# EAGLE design BMSMAX14921Based (EAGLE 8.3.1)
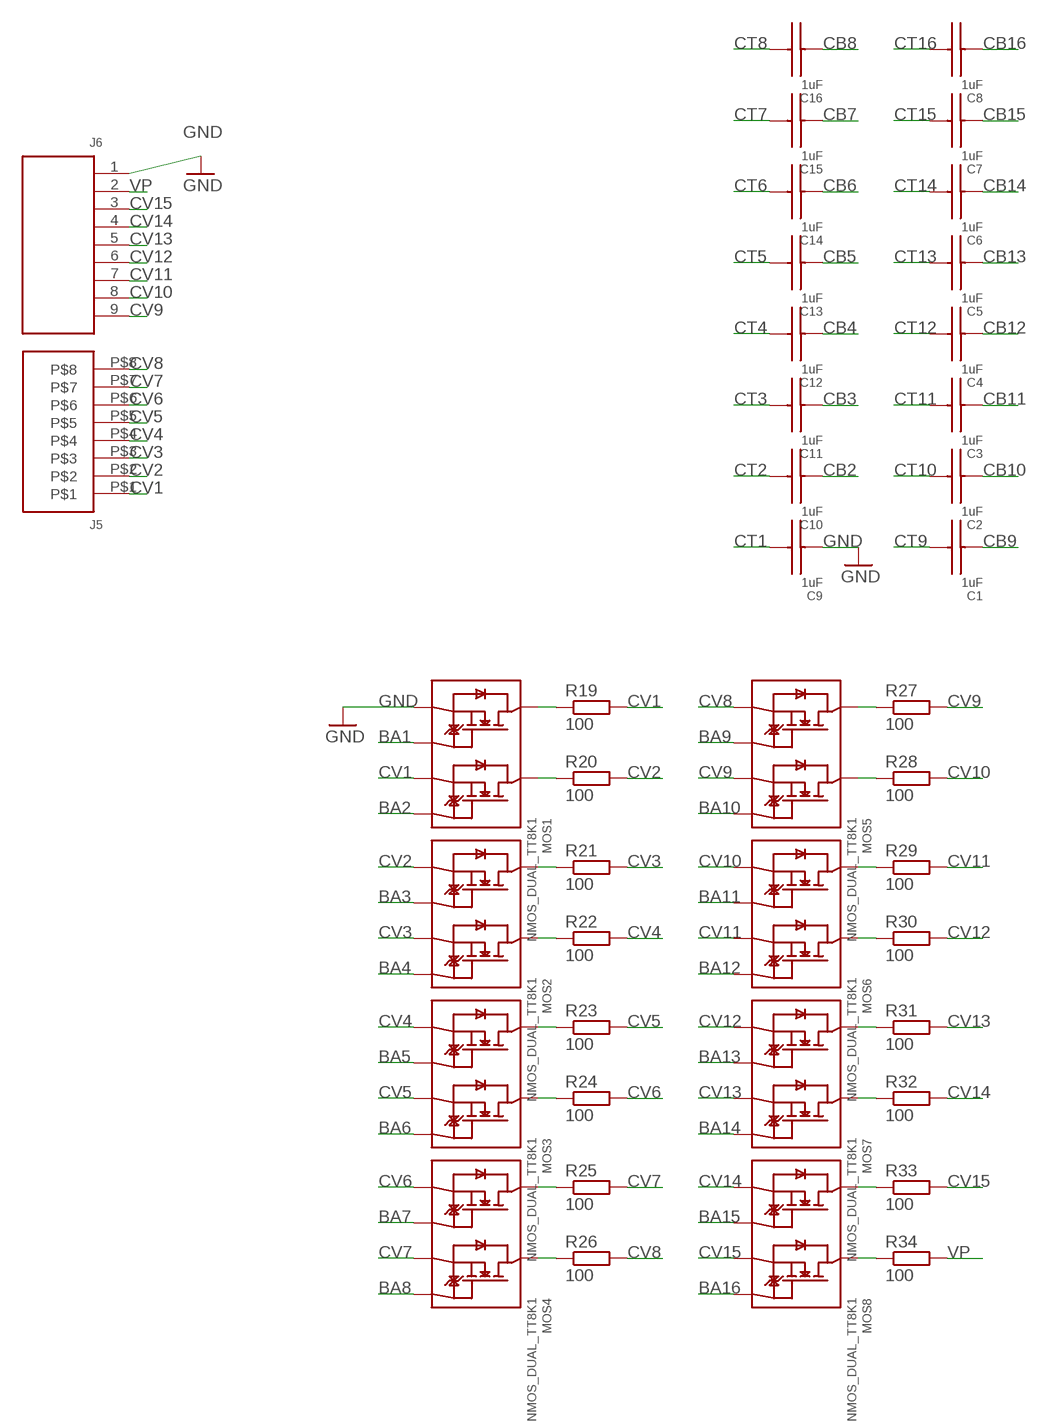
[diagram p0: schematic, sheet 1, part 1 of 2]
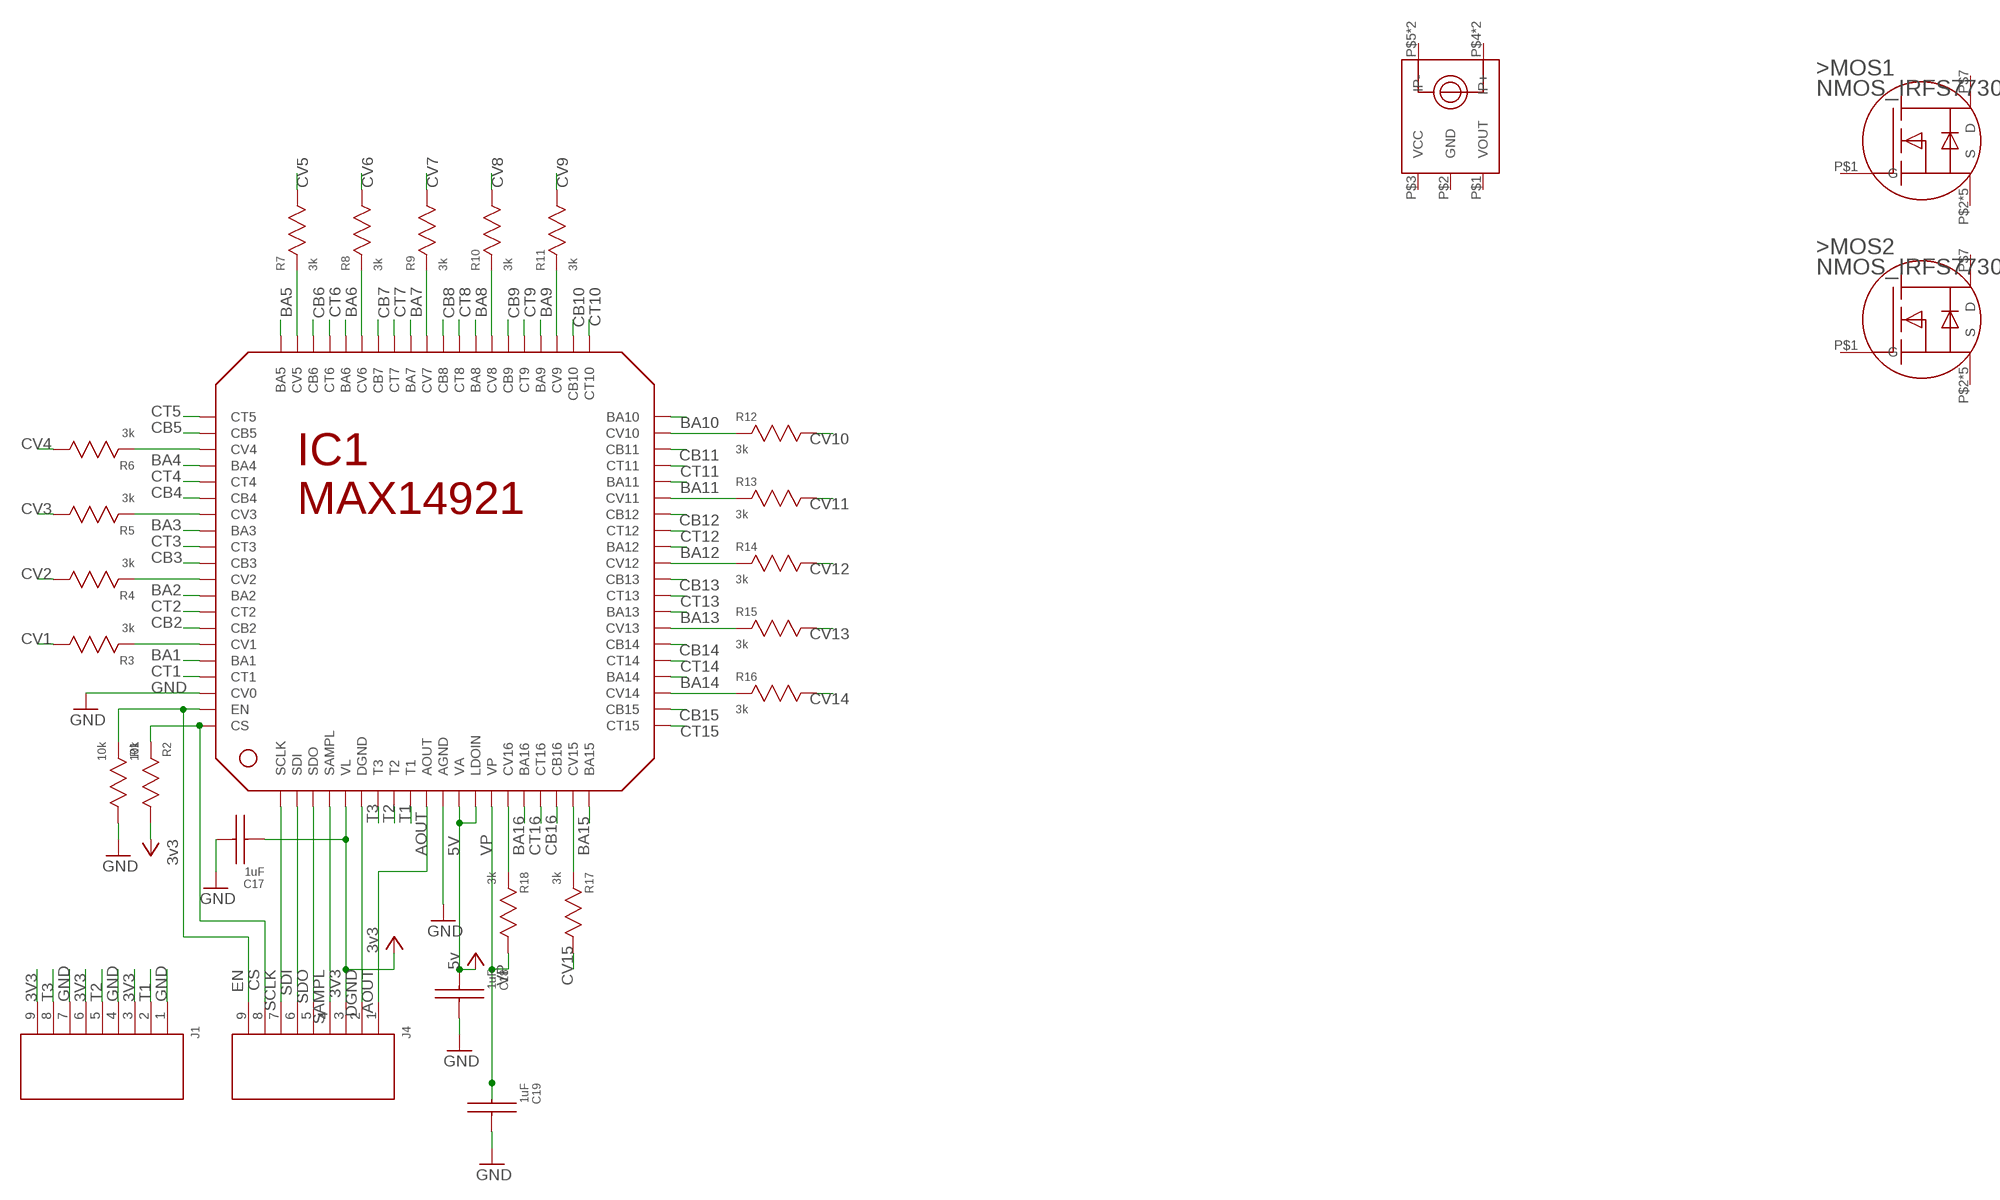
[diagram p1: schematic, sheet 1, part 2 of 2]

## Parts
>MOS1  NMOS_IRFS7730  [D2PAK-7PIN]
>MOS2  NMOS_IRFS7730  [D2PAK-7PIN]
C1  1uF  CHIP_CAP0805  [0805_(2012_METRIC)]
C2  1uF  CHIP_CAP0805  [0805_(2012_METRIC)]
C3  1uF  CHIP_CAP0805  [0805_(2012_METRIC)]
C4  1uF  CHIP_CAP0805  [0805_(2012_METRIC)]
C5  1uF  CHIP_CAP0805  [0805_(2012_METRIC)]
C6  1uF  CHIP_CAP0805  [0805_(2012_METRIC)]
C7  1uF  CHIP_CAP0805  [0805_(2012_METRIC)]
C8  1uF  CHIP_CAP0805  [0805_(2012_METRIC)]
C9  1uF  CHIP_CAP0805  [0805_(2012_METRIC)]
C10  1uF  CHIP_CAP0805  [0805_(2012_METRIC)]
C11  1uF  CHIP_CAP0805  [0805_(2012_METRIC)]
C12  1uF  CHIP_CAP0805  [0805_(2012_METRIC)]
C13  1uF  CHIP_CAP0805  [0805_(2012_METRIC)]
C14  1uF  CHIP_CAP0805  [0805_(2012_METRIC)]
C15  1uF  CHIP_CAP0805  [0805_(2012_METRIC)]
C16  1uF  CHIP_CAP0805  [0805_(2012_METRIC)]
C17  1uF  CHIP_CAP0805  [0805_(2012_METRIC)]
C18  1uF  CHIP_CAP0805  [0805_(2012_METRIC)]
C19  1uF  CHIP_CAP0805  [0805_(2012_METRIC)]
IC1  MAX14921  [80TQFP]
J1  CONNECTOR_9PIN  [9PIN_.1']
J4  CONNECTOR_9PIN  [9PIN_.1']
J5  CONNECTOR_8PIN  [8PIN_.1']
J6  CONNECTOR_9PIN  [9PIN_.1']
MOS1  NMOS_DUAL_TT8K1  [TSST8]
MOS2  NMOS_DUAL_TT8K1  [TSST8]
MOS3  NMOS_DUAL_TT8K1  [TSST8]
MOS4  NMOS_DUAL_TT8K1  [TSST8]
MOS5  NMOS_DUAL_TT8K1  [TSST8]
MOS6  NMOS_DUAL_TT8K1  [TSST8]
MOS7  NMOS_DUAL_TT8K1  [TSST8]
MOS8  NMOS_DUAL_TT8K1  [TSST8]
R1  10k  CHIP_RES0805  [0805_(2012_METRIC)]
R2  10k  CHIP_RES0805  [0805_(2012_METRIC)]
R3  3k  CHIP_RES0805  [0805_(2012_METRIC)]
R4  3k  CHIP_RES0805  [0805_(2012_METRIC)]
R5  3k  CHIP_RES0805  [0805_(2012_METRIC)]
R6  3k  CHIP_RES0805  [0805_(2012_METRIC)]
R7  3k  CHIP_RES0805  [0805_(2012_METRIC)]
R8  3k  CHIP_RES0805  [0805_(2012_METRIC)]
R9  3k  CHIP_RES0805  [0805_(2012_METRIC)]
R10  3k  CHIP_RES0805  [0805_(2012_METRIC)]
R11  3k  CHIP_RES0805  [0805_(2012_METRIC)]
R12  3k  CHIP_RES0805  [0805_(2012_METRIC)]
R13  3k  CHIP_RES0805  [0805_(2012_METRIC)]
R14  3k  CHIP_RES0805  [0805_(2012_METRIC)]
R15  3k  CHIP_RES0805  [0805_(2012_METRIC)]
R16  3k  CHIP_RES0805  [0805_(2012_METRIC)]
R17  3k  CHIP_RES0805  [0805_(2012_METRIC)]
R18  3k  CHIP_RES0805  [0805_(2012_METRIC)]
R19  100  R-EU_0411/3V  [0411V]
R20  100  R-EU_0411/3V  [0411V]
R21  100  R-EU_0411/3V  [0411V]
R22  100  R-EU_0411/3V  [0411V]
R23  100  R-EU_0411/3V  [0411V]
R24  100  R-EU_0411/3V  [0411V]
R25  100  R-EU_0411/3V  [0411V]
R26  100  R-EU_0411/3V  [0411V]
R27  100  R-EU_0411/3V  [0411V]
R28  100  R-EU_0411/3V  [0411V]
R29  100  R-EU_0411/3V  [0411V]
R30  100  R-EU_0411/3V  [0411V]
R31  100  R-EU_0411/3V  [0411V]
R32  100  R-EU_0411/3V  [0411V]
R33  100  R-EU_0411/3V  [0411V]
R34  100  R-EU_0411/3V  [0411V]
U$1  ACS758XCB  [CB5PFF]

## Nets
3V3: C17.P$2 IC1.5(VL) J1.3 J1.6 J1.9 J4.3 R2.P$1 ; supply symbol labelled 3v3
5V: C18.P$2 IC1.12(VA) IC1.13(LDOIN) ; supply symbol labelled 5v
AOUT: IC1.10(AOUT) J4.1
BA1: IC1.76(BA1) MOS1.P$2(G1)
BA2: IC1.72(BA2) MOS1.P$4(G2)
BA3: IC1.68(BA3) MOS2.P$2(G1)
BA4: IC1.64(BA4) MOS2.P$4(G2)
BA5: IC1.60(BA5) MOS3.P$2(G1)
BA6: IC1.56(BA6) MOS3.P$4(G2)
BA7: IC1.52(BA7) MOS4.P$2(G1)
BA8: IC1.48(BA8) MOS4.P$4(G2)
BA9: IC1.44(BA9) MOS5.P$2(G1)
BA10: IC1.40(BA10) MOS5.P$4(G2)
BA11: IC1.36(BA11) MOS6.P$2(G1)
BA12: IC1.32(BA12) MOS6.P$4(G2)
BA13: IC1.28(BA13) MOS7.P$2(G1)
BA14: IC1.24(BA14) MOS7.P$4(G2)
BA15: IC1.20(BA15) MOS8.P$2(G1)
BA16: IC1.16(BA16) MOS8.P$4(G2)
CB2: C10.P$2 IC1.74(CB2)
CB3: C11.P$2 IC1.70(CB3)
CB4: C12.P$2 IC1.66(CB4)
CB5: C13.P$2 IC1.62(CB5)
CB6: C14.P$2 IC1.58(CB6)
CB7: C15.P$2 IC1.54(CB7)
CB8: C16.P$2 IC1.50(CB8)
CB9: C1.P$2 IC1.46(CB9)
CB10: C2.P$2 IC1.42(CB10)
CB11: C3.P$2 IC1.38(CB11)
CB12: C4.P$2 IC1.34(CB12)
CB13: C5.P$2 IC1.30(CB13)
CB14: C6.P$2 IC1.26(CB14)
CB15: C7.P$2 IC1.22(CB15)
CB16: C8.P$2 IC1.18(CB16)
CS: IC1.80(CS) J4.8 R2.P$2
CT1: C9.P$1 IC1.77(CT1)
CT2: C10.P$1 IC1.73(CT2)
CT3: C11.P$1 IC1.69(CT3)
CT4: C12.P$1 IC1.65(CT4)
CT5: C13.P$1 IC1.61(CT5)
CT6: C14.P$1 IC1.57(CT6)
CT7: C15.P$1 IC1.53(CT7)
CT8: C16.P$1 IC1.49(CT8)
CT9: C1.P$1 IC1.45(CT9)
CT10: C2.P$1 IC1.41(CT10)
CT11: C3.P$1 IC1.37(CT11)
CT12: C4.P$1 IC1.33(CT12)
CT13: C5.P$1 IC1.29(CT13)
CT14: C6.P$1 IC1.25(CT14)
CT15: C7.P$1 IC1.21(CT15)
CT16: C8.P$1 IC1.17(CT16)
CV1: J5.P$1 MOS1.P$3(S2) R3.P$1 R19.2
CV2: J5.P$2 MOS2.P$1(S1) R4.P$1 R20.2
CV3: J5.P$3 MOS2.P$3(S2) R5.P$1 R21.2
CV4: J5.P$4 MOS3.P$1(S1) R6.P$1 R22.2
CV5: J5.P$5 MOS3.P$3(S2) R7.P$1 R23.2
CV6: J5.P$6 MOS4.P$1(S1) R8.P$1 R24.2
CV7: J5.P$7 MOS4.P$3(S2) R9.P$1 R25.2
CV8: J5.P$8 MOS5.P$1(S1) R10.P$1 R26.2
CV9: J6.9 MOS5.P$3(S2) R11.P$1 R27.2
CV10: J6.8 MOS6.P$1(S1) R12.P$1 R28.2
CV11: J6.7 MOS6.P$3(S2) R13.P$1 R29.2
CV12: J6.6 MOS7.P$1(S1) R14.P$1 R30.2
CV13: J6.5 MOS7.P$3(S2) R15.P$1 R31.2
CV14: J6.4 MOS8.P$1(S1) R16.P$1 R32.2
CV15: J6.3 MOS8.P$3(S2) R17.P$1 R33.2
DGND: IC1.6(DGND) J4.2
EN: IC1.79(EN) J4.9 R1.P$2
GND: C9.P$2 C17.P$1 C18.P$1 C19.P$1 IC1.11(AGND) IC1.78(CV0) J1.1 J1.4 J1.7 J6.1 MOS1.P$1(S1) R1.P$1
N$2: MOS1.P$7(D1) MOS1.P$8(D1) R19.1
N$9: IC1.71(CV2) R4.P$2
N$11: IC1.67(CV3) R5.P$2
N$12: IC1.75(CV1) R3.P$2
N$26: IC1.63(CV4) R6.P$2
N$29: IC1.59(CV5) R7.P$2
N$30: IC1.55(CV6) R8.P$2
N$31: IC1.51(CV7) R9.P$2
N$32: IC1.47(CV8) R10.P$2
N$33: IC1.43(CV9) R11.P$2
N$34: IC1.39(CV10) R12.P$2
N$35: IC1.35(CV11) R13.P$2
N$36: IC1.31(CV12) R14.P$2
N$37: IC1.27(CV13) R15.P$2
N$38: IC1.23(CV14) R16.P$2
N$39: IC1.19(CV15) R17.P$2
N$40: IC1.15(CV16) R18.P$2
N$41: MOS1.P$5(D2) MOS1.P$6(D2) R20.1
N$42: MOS2.P$7(D1) MOS2.P$8(D1) R21.1
N$43: MOS2.P$5(D2) MOS2.P$6(D2) R22.1
N$44: MOS3.P$7(D1) MOS3.P$8(D1) R23.1
N$45: MOS3.P$5(D2) MOS3.P$6(D2) R24.1
N$46: MOS4.P$7(D1) MOS4.P$8(D1) R25.1
N$47: MOS4.P$5(D2) MOS4.P$6(D2) R26.1
N$48: MOS5.P$7(D1) MOS5.P$8(D1) R27.1
N$49: MOS5.P$5(D2) MOS5.P$6(D2) R28.1
N$50: MOS6.P$7(D1) MOS6.P$8(D1) R29.1
N$51: MOS6.P$5(D2) MOS6.P$6(D2) R30.1
N$52: MOS7.P$7(D1) MOS7.P$8(D1) R31.1
N$53: MOS7.P$5(D2) MOS7.P$6(D2) R32.1
N$54: MOS8.P$7(D1) MOS8.P$8(D1) R33.1
N$55: MOS8.P$5(D2) MOS8.P$6(D2) R34.1
SAMPL: IC1.4(SAMPL) J4.4
SCLK: IC1.1(SCLK) J4.7
SDI: IC1.2(SDI) J4.6
SDO: IC1.3(SDO) J4.5
T1: IC1.9(T1) J1.2
T2: IC1.8(T2) J1.5
T3: IC1.7(T3) J1.8
VP: C19.P$2 IC1.14(VP) J6.2 R18.P$1 R34.2
Unconnected: >MOS1.P$1(G) >MOS1.P$2(S) >MOS1.P$3(S) >MOS1.P$4(S) >MOS1.P$5(S) >MOS1.P$6(S) >MOS1.P$7(D) >MOS2.P$1(G) >MOS2.P$2(S) >MOS2.P$3(S) >MOS2.P$4(S) >MOS2.P$5(S) >MOS2.P$6(S) >MOS2.P$7(D) U$1.P$1(VOUT) U$1.P$2(GND) U$1.P$3(VCC) U$1.P$4(IP+) U$1.P$4_2(IP+) U$1.P$5(IP-) U$1.P$5_2(IP-)

## Library data of the parts
>MOS1 >MOS2 = MarkIIEaglelbr:NMOS_IRFS7730
C1-C19 = lolomolo:CHIP_CAP
IC1 = MarkIIEaglelbr:MAX14921
J1 J4 J6 = lolomolo:CONNECTOR_9PIN
J5 = lolomolo:CONNECTOR_8PIN
MOS1-MOS8 = MarkIIEaglelbr:NMOS_DUAL_TT8K1
R1-R18 = lolomolo:CHIP_RES
R19-R34 = rcl:R-EU_: RESISTOR, European symbol
U$1 = MarkIIEaglelbr:ACS758XCB

## Board
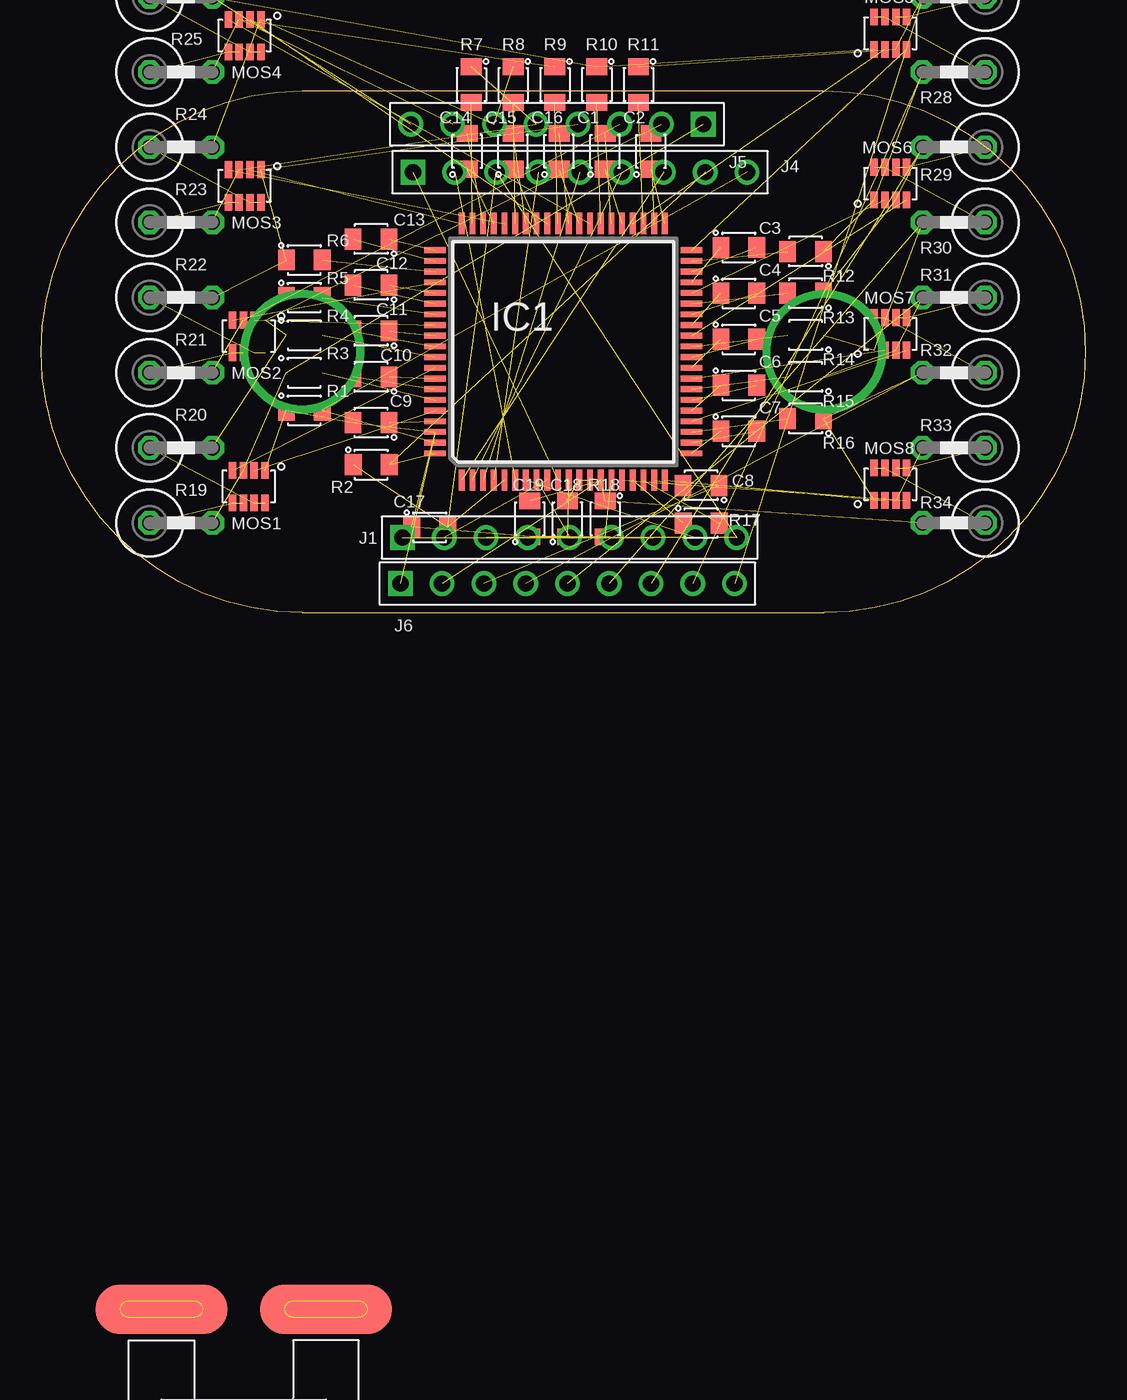
[diagram p2: board, top side]
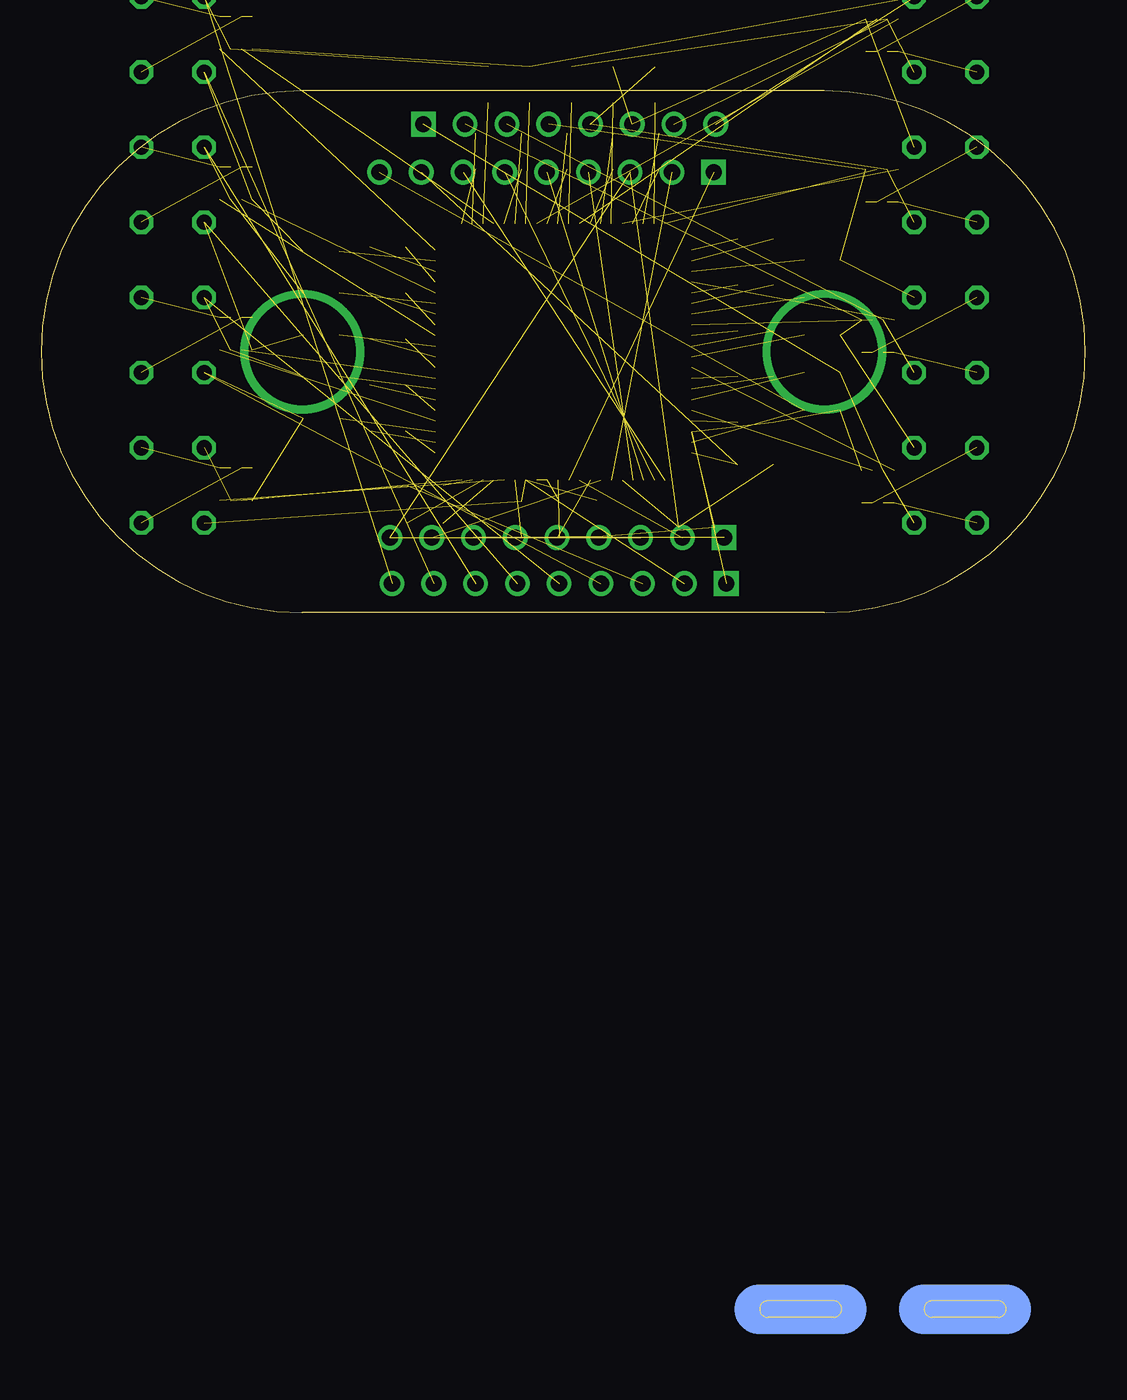
[diagram p3: board, bottom side, seen from below]

Size 63.5 x 31.75 mm. Coordinates in mm from the lower left corner, seen from the top.
Outline: 15.88,0 47.62,0 arc180 47.62,31.75 15.88,31.75 arc180 15.88,0
Copper layers (1*16): Top 0.035mm / dielectric 1.5mm / Bottom 0.035mm
Design rules "default": minimum track width 6mil, minimum drill 0.35mm, track to track 6mil, track to pad 6mil, pad to pad 6mil, via to via 6mil, smd to smd 6mil, copper to edge 40mil, drill to drill 6mil, minimum pad ring 10mil, minimum via ring 8mil, stop-mask expansion 4mil, vias tented up to drill 0mil, thermal gap 10mil

### Footprints (pad centres in the part's own frame; a part is rotated, then mirrored left to right if it is on the bottom)
D2PAK-7PIN = smd 0.762 x 2.54: P$1 -3.81,-1.27; P$2 -2.54,-1.27; P$3 -1.27,-1.27; P$4 1.27,-1.27; P$5 2.54,-1.27; P$6 3.81,-1.27 | smd 10.16 x 11.43: P$7 0,8.89
0805_(2012_METRIC) = smd 1.016 x 1.27: P$1 -1.087,0; P$2 1.097,0
80TQFP = smd 0.35 x 1.3: 1 -6.175,-7.8; 2 -5.525,-7.8; 3 -4.875,-7.8; 4 -4.225,-7.8; 5 -3.575,-7.8; 6 -2.925,-7.8; 7 -2.275,-7.8; 8 -1.625,-7.8; 9 -0.975,-7.8; 10 -0.325,-7.8; 11 0.325,-7.8; 12 0.975,-7.8; 13 1.625,-7.8; 14 2.275,-7.8; 15 2.925,-7.8; 16 3.575,-7.8; 17 4.225,-7.8; 18 4.875,-7.8; 19 5.525,-7.8; 20 6.175,-7.8; 41 6.175,7.8; 42 5.525,7.8; 43 4.875,7.8; 44 4.225,7.8; 45 3.575,7.8; 46 2.925,7.8; 47 2.275,7.8; 48 1.625,7.8; 49 0.975,7.8; 50 0.325,7.8; 51 -0.325,7.8; 52 -0.975,7.8; 53 -1.625,7.8; 54 -2.275,7.8; 55 -2.925,7.8; 56 -3.575,7.8; 57 -4.225,7.8; 58 -4.875,7.8; 59 -5.525,7.8; 60 -6.175,7.8 | smd 1.3 x 0.35: 21 7.8,-6.175; 22 7.8,-5.525; 23 7.8,-4.875; 24 7.8,-4.225; 25 7.8,-3.575; 26 7.8,-2.925; 27 7.8,-2.275; 28 7.8,-1.625; 29 7.8,-0.975; 30 7.8,-0.325; 31 7.8,0.325; 32 7.8,0.975; 33 7.8,1.625; 34 7.8,2.275; 35 7.8,2.925; 36 7.8,3.575; 37 7.8,4.225; 38 7.8,4.875; 39 7.8,5.525; 40 7.8,6.175; 61 -7.8,6.175; 62 -7.8,5.525; 63 -7.8,4.875; 64 -7.8,4.225; 65 -7.8,3.575; 66 -7.8,2.925; 67 -7.8,2.275; 68 -7.8,1.625; 69 -7.8,0.975; 70 -7.8,0.325; 71 -7.8,-0.325; 72 -7.8,-0.975; 73 -7.8,-1.625; 74 -7.8,-2.275; 75 -7.8,-2.925; 76 -7.8,-3.575; 77 -7.8,-4.225; 78 -7.8,-4.875; 79 -7.8,-5.525; 80 -7.8,-6.175
9PIN_.1' = drill 0.991 square: 1 -10.16,0 | drill 0.991: 2 -7.62,0; 3 -5.08,0; 4 -2.54,0; 5 0,0; 6 2.54,0; 7 5.08,0; 8 7.62,0; 9 10.16,0
8PIN_.1' = drill 0.991 square: P$1 -8.89,0 | drill 0.991: P$2 -6.35,0; P$3 -3.81,0; P$4 -1.27,0; P$5 1.27,0; P$6 3.81,0; P$7 6.35,0; P$8 8.89,0
TSST8 = smd 0.457 x 1.016: P$1 -0.66,-0.914; P$2 0,-0.914; P$3 0.66,-0.914; P$4 1.321,-0.914; P$5 -0.66,1.067; P$6 0,1.067; P$7 0.66,1.067; P$8 1.321,1.067
0411V = drill 0.914 octagon: 1 -2.54,0; 2 1.27,0
CB5PFF = drill 0.813: P$1 -1.905,0; P$2 0,0; P$3 1.905,0 | smd 8 x 3: P$4 5,21.4; P$5 -5,21.4 | smd 8 x 3 bottom: P$4_2 5,21.4; P$5_2 -5,21.4

### Placement (x,y rotation side)
>MOS1  -14.22,-60.2 0 top  (outside the outline)
>MOS2  -30.61,-60.2 0 top  (outside the outline)
C1  34.29,28.07 90 top
C2  37.08,28.07 90 top
C3  42.42,22.23 0 top
C4  42.42,19.43 0 top
C5  42.42,16.64 0 top
C6  42.42,13.84 0 top
C7  42.42,11.05 0 top
C8  40.13,5.46 0 top
C9  20.07,11.56 180 top
C10  20.07,14.35 180 top
C11  20.07,17.15 180 top
C12  20.07,19.94 180 top
C13  20.07,22.73 180 top
C14  25.91,28.07 90 top
C15  28.7,28.07 90 top
C16  31.5,28.07 90 top
C17  23.62,5.21 0 top
C18  32,5.72 90 top
C19  29.72,5.72 90 top
IC1  31.75,15.88 0 top
J1  32.13,4.57 0 top
J4  32.77,26.8 0 top
J5  31.37,29.72 180 top
J6  32,1.78 0 top
MOS1  12.95,7.75 180 top
MOS2  12.95,16.89 180 top
MOS3  12.7,26.04 180 top
MOS4  12.7,35.18 180 top
MOS5  51.31,35.18 0 top
MOS6  51.31,26.04 0 top
MOS7  51.31,16.89 0 top
MOS8  51.31,7.75 0 top
R1  16,12.32 0 top
R2  20.07,9.02 0 top
R3  16,14.61 0 top
R4  16,16.89 0 top
R5  16,19.18 0 top
R6  16,21.46 0 top
R7  26.16,32.13 270 top
R8  28.7,32.13 270 top
R9  31.24,32.13 270 top
R10  33.78,32.13 270 top
R11  36.32,32.13 270 top
R12  46.48,21.97 180 top
R13  46.48,19.43 180 top
R14  46.48,16.89 180 top
R15  46.48,14.35 180 top
R16  46.48,11.81 180 top
R17  40.13,7.75 180 top
R18  34.29,5.72 270 top
R19  9.14,5.46 0 top
R20  9.14,10.03 0 top
R21  9.14,14.61 0 top
R22  9.14,19.18 0 top
R23  9.14,23.75 0 top
R24  9.14,28.32 0 top
R25  9.14,32.89 0 top
R26  9.14,37.47 0 top  (outside the outline)
R27  54.86,37.47 180 top  (outside the outline)
R28  54.86,32.89 180 top
R29  54.86,28.32 180 top
R30  54.86,23.75 180 top
R31  54.86,19.18 180 top
R32  54.86,14.61 180 top
R33  54.86,10.03 180 top
R34  54.86,5.46 180 top
U$1  12.32,-63.75 0 top  (outside the outline)

### Tracks (layer width: path | path; a pad name or v marks a point on that pad's centre or on a via)
3V3  (6 unrouted)
5V  (2 unrouted)
AOUT  (1 unrouted)
BA1  (1 unrouted)
BA2  (1 unrouted)
BA3  (1 unrouted)
BA4  (1 unrouted)
BA5  (1 unrouted)
BA6  (1 unrouted)
BA7  (1 unrouted)
BA8  (1 unrouted)
BA9  (1 unrouted)
BA10  (1 unrouted)
BA11  (1 unrouted)
BA12  (1 unrouted)
BA13  (1 unrouted)
BA14  (1 unrouted)
BA15  (1 unrouted)
BA16  (1 unrouted)
CB2  (1 unrouted)
CB3  (1 unrouted)
CB4  (1 unrouted)
CB5  (1 unrouted)
CB6  (1 unrouted)
CB7  (1 unrouted)
CB8  (1 unrouted)
CB9  (1 unrouted)
CB10  (1 unrouted)
CB11  (1 unrouted)
CB12  (1 unrouted)
CB13  (1 unrouted)
CB14  (1 unrouted)
CB15  (1 unrouted)
CB16  (1 unrouted)
CS  (2 unrouted)
CT1  (1 unrouted)
CT2  (1 unrouted)
CT3  (1 unrouted)
CT4  (1 unrouted)
CT5  (1 unrouted)
CT6  (1 unrouted)
CT7  (1 unrouted)
CT8  (1 unrouted)
CT9  (1 unrouted)
CT10  (1 unrouted)
CT11  (1 unrouted)
CT12  (1 unrouted)
CT13  (1 unrouted)
CT14  (1 unrouted)
CT15  (1 unrouted)
CT16  (1 unrouted)
CV1  (3 unrouted)
CV2  (3 unrouted)
CV3  (3 unrouted)
CV4  (3 unrouted)
CV5  (3 unrouted)
CV6  (3 unrouted)
CV7  (3 unrouted)
CV8  (3 unrouted)
CV9  (3 unrouted)
CV10  (3 unrouted)
CV11  (3 unrouted)
CV12  (3 unrouted)
CV13  (3 unrouted)
CV14  (3 unrouted)
CV15  (3 unrouted)
DGND  (1 unrouted)
EN  (2 unrouted)
GND  (11 unrouted)
N$1  (via drill 6.5)
  other vias: 15.88,15.88
N$2  (2 unrouted)
N$3  (via drill 6.5)
  other vias: 47.62,15.88
N$9  (1 unrouted)
N$11  (1 unrouted)
N$12  (1 unrouted)
N$26  (1 unrouted)
N$29  (1 unrouted)
N$30  (1 unrouted)
N$31  (1 unrouted)
N$32  (1 unrouted)
N$33  (1 unrouted)
N$34  (1 unrouted)
N$35  (1 unrouted)
N$36  (1 unrouted)
N$37  (1 unrouted)
N$38  (1 unrouted)
N$39  (1 unrouted)
N$40  (1 unrouted)
N$41  (2 unrouted)
N$42  (2 unrouted)
N$43  (2 unrouted)
N$44  (2 unrouted)
N$45  (2 unrouted)
N$46  (2 unrouted)
N$47  (2 unrouted)
N$48  (2 unrouted)
N$49  (2 unrouted)
N$50  (2 unrouted)
N$51  (2 unrouted)
N$52  (2 unrouted)
N$53  (2 unrouted)
N$54  (2 unrouted)
N$55  (2 unrouted)
SAMPL  (1 unrouted)
SCLK  (1 unrouted)
SDI  (1 unrouted)
SDO  (1 unrouted)
T1  (1 unrouted)
T2  (1 unrouted)
T3  (1 unrouted)
VP  (4 unrouted)